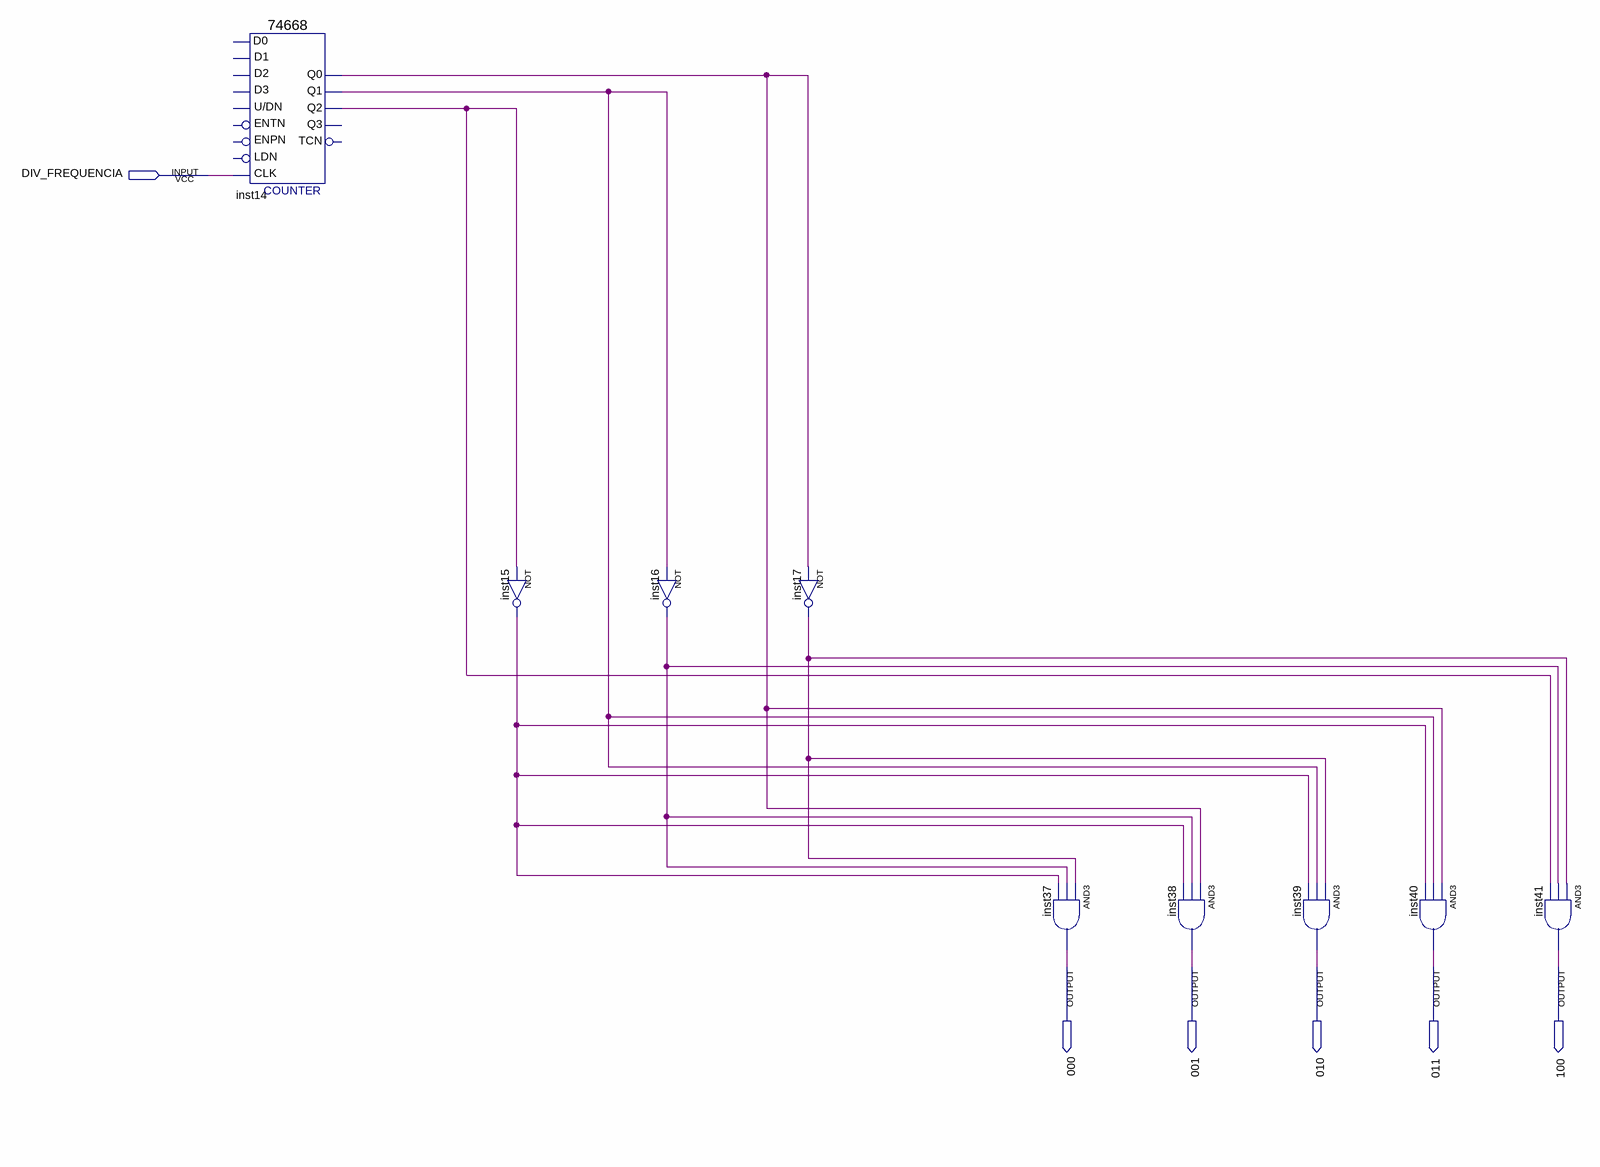
[diagram p0: schematic sheet]
// Quartus schematic CONTADOR.bdf as structural Verilog: 9 symbols, 6 pins
module CONTADOR (
  input  DIV_FREQUENCIA,
  output \000 ,
  output \001 ,
  output \010 ,
  output \011 ,
  output \100 
);

  wire inst14_q0, inst14_q1, inst14_q2, inst15_out, inst16_out, inst17_out;

  \74668  inst14 (
    .CLK(DIV_FREQUENCIA), .Q2(inst14_q2), .Q1(inst14_q1), .Q0(inst14_q0));  // open: D1, D0, ENTN, U/DN, D3, D2, LDN, ENPN, TCN, Q3
  not inst15 (inst15_out, inst14_q2);
  not inst16 (inst16_out, inst14_q1);
  not inst17 (inst17_out, inst14_q0);
  and inst37 (\000 , inst17_out, inst16_out, inst15_out);
  and inst38 (\001 , inst14_q0, inst16_out, inst15_out);
  and inst39 (\010 , inst17_out, inst14_q1, inst15_out);
  and inst40 (\011 , inst14_q0, inst14_q1, inst15_out);
  and inst41 (\100 , inst17_out, inst16_out, inst14_q2);
endmodule
